# Altium schematic sheet 9.PCIE3.SchDoc
size 420 x 297 mm; SheetNumber: 9; SheetTotal: 13
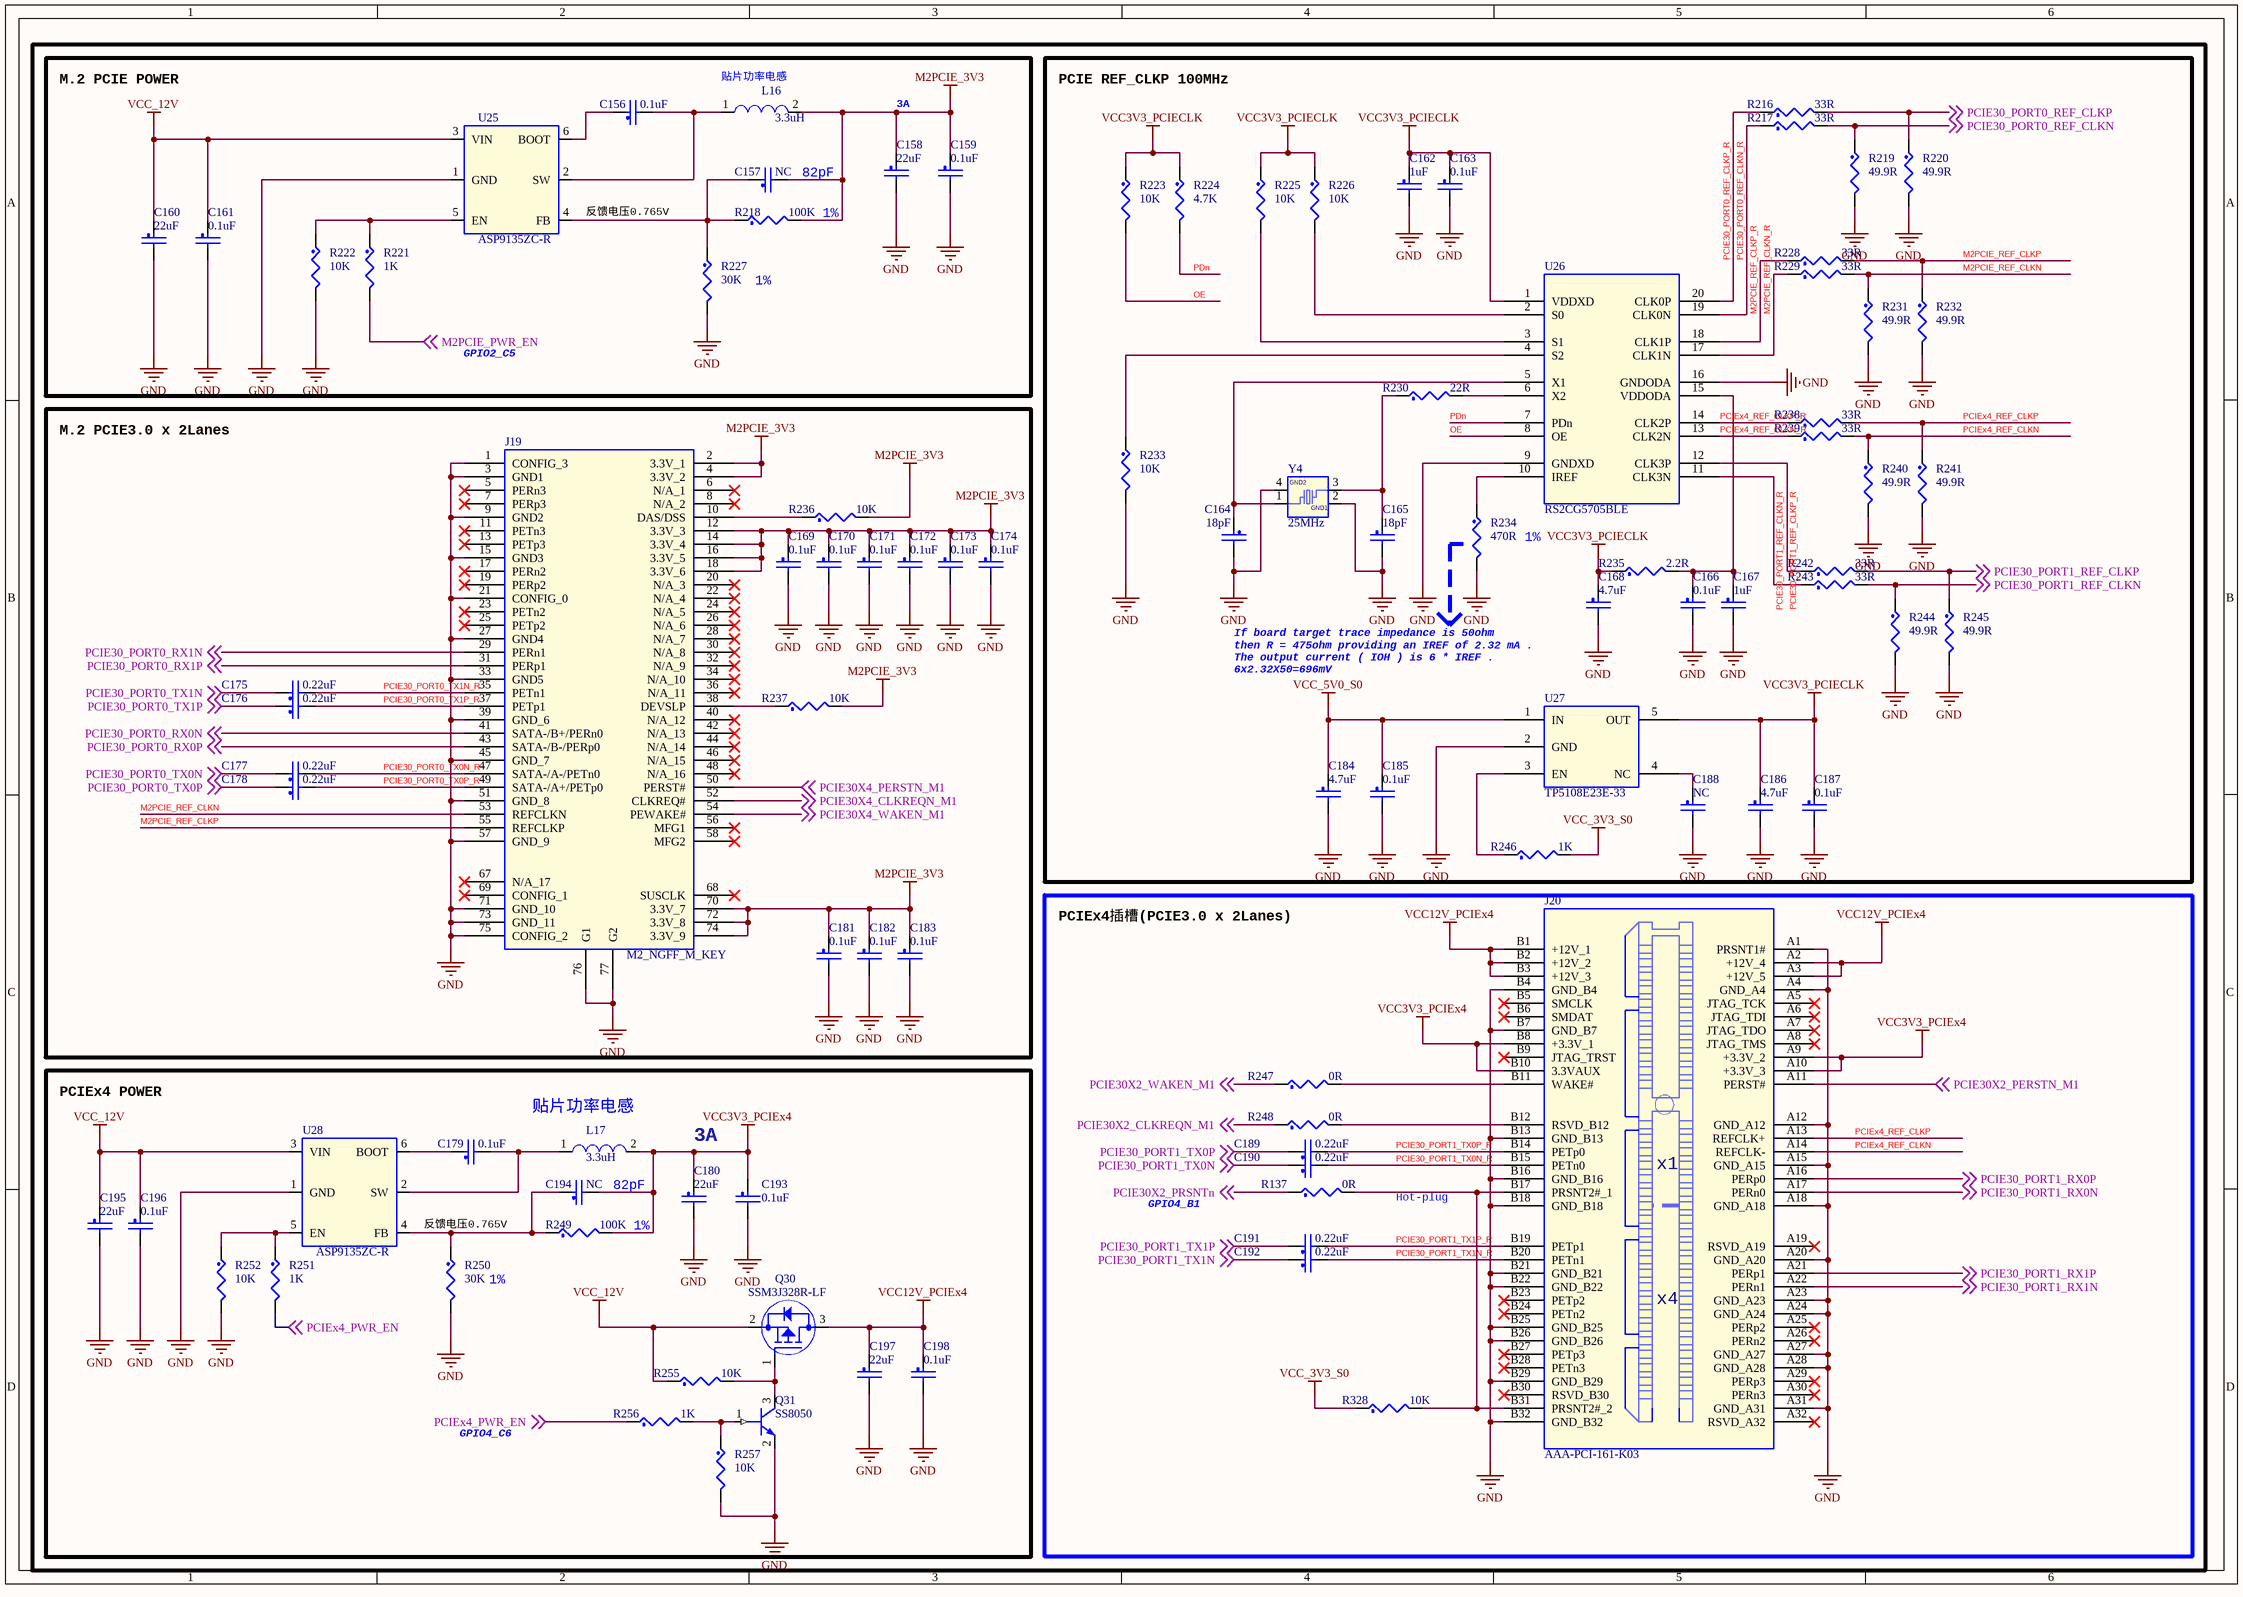
[diagram p0: 9.PCIE3.SchDoc]

## Parts
C156  0.1uF  [C0402]
C157  NC  [C0402]
C158  22uF  [C0603]
C159  0.1uF  [C0402]
C160  22uF  [C0603]
C161  0.1uF  [C0402]
C162  1uF  [C0402]
C163  0.1uF  [C0402]
C164  18pF  [C0402]
C165  18pF  [C0402]
C166  0.1uF  [C0402]
C167  1uF  [C0402]
C168  4.7uF  [C0402]
C169  0.1uF  [C0402]
C170  0.1uF  [C0402]
C171  0.1uF  [C0402]
C172  0.1uF  [C0402]
C173  0.1uF  [C0402]
C174  0.1uF  [C0402]
C175  0.22uF  [C0402]
C176  0.22uF  [C0402]
C177  0.22uF  [C0402]
C178  0.22uF  [C0402]
C179  0.1uF  [C0402]
C180  22uF  [C0603]
C181  0.1uF  [C0402]
C182  0.1uF  [C0402]
C183  0.1uF  [C0402]
C184  4.7uF  [C0402]
C185  0.1uF  [C0402]
C186  4.7uF  [C0402]
C187  0.1uF  [C0402]
C188  NC  [C0402]
C189  0.22uF  [C0402]
C190  0.22uF  [C0402]
C191  0.22uF  [C0402]
C192  0.22uF  [C0402]
C193  0.1uF  [C0402]
C194  NC  [C0402]
C195  22uF  [C0603]
C196  0.1uF  [C0402]
C197  22uF  [C0603]
C198  0.1uF  [C0402]
J19  M2_NGFF_M_KEY  [M2_NGFF_M_KEY]
J20  AAA-PCI-161-K03  [PCIE_64PIN_1R00]
L16  3.3uH  [l4520]
L17  3.3uH  [l4520]
Q30  SSM3J328R-LF  [SOT23]
Q31  SS8050  [SOT23]
R137  0R  [R0402]
R216  33R  [R0402]
R217  33R  [R0402]
R218  100K  [R0402]
R219  49.9R  [R0402]
R220  49.9R  [R0402]
R221  1K  [R0402]
R222  10K  [R0402]
R223  10K  [R0402]
R224  4.7K  [R0402]
R225  10K  [R0402]
R226  10K  [R0402]
R227  30K  [R0402]
R228  33R  [R0402]
R229  33R  [R0402]
R230  22R  [R0402]
R231  49.9R  [R0402]
R232  49.9R  [R0402]
R233  10K  [R0402]
R234  470R  [R0402]
R235  2.2R  [R0402]
R236  10K  [R0402]
R237  10K  [R0402]
R238  33R  [R0402]
R239  33R  [R0402]
R240  49.9R  [R0402]
R241  49.9R  [R0402]
R242  33R  [R0402]
R243  33R  [R0402]
R244  49.9R  [R0402]
R245  49.9R  [R0402]
R246  1K  [R0402]
R247  0R  [R0402]
R248  0R  [R0402]
R249  100K  [R0402]
R250  30K  [R0402]
R251  1K  [R0402]
R252  10K  [R0402]
R255  10K  [R0402]
R256  1K  [R0402]
R257  10K  [R0402]
R328  10K  [R0402]
U25  ASP9135ZC-R  [SOT23_6]
U26  RS2CG5705BLE  [TSSOP20]
U27  TP5108E23E-33  [SOT23-5]
U28  ASP9135ZC-R  [SOT23_6]
Y4  25MHz  [3225]

## Blocks framed on the sheet
M.2 PCIE POWER: C156-C161 L16 R218 R221 R222 R227 U25
PCIE REF_CLKP 100MHz: C162-C168 C184-C188 R216 R217 R219 R220 R223-R226 R228-R235 R238-R246 U26 U27 Y4
M.2 PCIE3.0 x 2Lanes: C169-C178 C181-C183 J19 R236 R237
PCIEx4插槽(PCIE3.0 x 2Lanes): C189-C192 J20 R137 R247 R248 R328
3A: C179 C180 C193-C198 L17 Q30 Q31 R249-R252 R255-R257 U28

## Nets
GND: C158.2 C159.2 C160.2 C161.2 C162.2 C163.2 C164.2 C165.2 C166.2 C167.2 C168.2 C169.2 C170.2 C171.2 C172.2 C173.2 C174.2 C180.2 C181.2 C182.2 C183.2 C184.2 C185.2 C186.2 C187.2 C188.2 C193.2 C195.2 C196.2 C197.2 C198.2 J19.1(CONFIG_3) J19.3(GND1) J19.9(GND2) J19.15(GND3) J19.21(CONFIG_0) J19.27(GND4) J19.33(GND5) J19.39(GND_6) J19.45(GND_7) J19.51(GND_8) J19.57(GND_9) J19.71(GND_10) J19.73(GND_11) J19.75(CONFIG_2) J19.76(G1) J19.77(G2) J20.A1(PRSNT1#) J20.A4(GND_A4) J20.A12(GND_A12) J20.A15(GND_A15) J20.A18(GND_A18) J20.A20(GND_A20) J20.A23(GND_A23) J20.A24(GND_A24) J20.A27(GND_A27) J20.A28(GND_A28) J20.A31(GND_A31) J20.B4(GND_B4) J20.B7(GND_B7) J20.B13(GND_B13) J20.B16(GND_B16) J20.B18(GND_B18) J20.B21(GND_B21) J20.B22(GND_B22) J20.B25(GND_B25) J20.B26(GND_B26) J20.B29(GND_B29) J20.B32(GND_B32) Q31.2(EMITTER) R219.2 R220.2 R222.2 R227.2 R231.2 R232.2 R233.2 R234.2 R240.2 R241.2 R244.2 R245.2 R250.2 R252.2 R257.2 U25.1(GND) U26.9(GNDXD) U26.16(GNDODA) U27.2(GND) U28.1(GND) Y4.2(GND1) Y4.4(GND2)
M2PCIE_3V3: C157.2 C158.1 C159.1 C169.1 C170.1 C171.1 C172.1 C173.1 C174.1 C181.1 C182.1 C183.1 J19.2(3.3V_1) J19.4(3.3V_2) J19.12(3.3V_3) J19.14(3.3V_4) J19.16(3.3V_5) J19.18(3.3V_6) J19.70(3.3V_7) J19.72(3.3V_8) J19.74(3.3V_9) L16.2 R218.2 R236.2 R237.2
VCC3V3_PCIECLK: C162.1 C163.1 C168.1 C186.1 C187.1 R223.1 R224.1 R225.1 R226.1 R235.1 U26.1(VDDXD) U27.5(OUT)
VCC3V3_PCIEx4: C180.1 C193.1 C194.2 J20.A9(+3.3V_2) J20.A10(+3.3V_3) J20.B8(+3.3V_1) J20.B10(3.3VAUX) L17.2 R249.2
VCC12V_PCIEx4: C197.1 C198.1 J20.A2(+12V_4) J20.A3(+12V_5) J20.B1(+12V_1) J20.B2(+12V_2) J20.B3(+12V_3) Q30.3(DRAIN)
VCC_3V3_S0: R246.2 R328.1
VCC_5V0_S0: C184.1 C185.1 U27.1(IN)
VCC_12V: C160.1 C161.1 C195.1 C196.1 Q30.2(SOURCE) R255.1 U25.3(VIN) U28.3(VIN)
M2PCIE_PWR_EN: R221.2 ; off-sheet M2PCIE_PWR_EN
M2PCIE_REF_CLKN: J19.53(REFCLKN) R229.2 R231.1
M2PCIE_REF_CLKN_R: R229.1 U26.17(CLK1N)
M2PCIE_REF_CLKP: J19.55(REFCLKP) R228.2 R232.1
M2PCIE_REF_CLKP_R: R228.1 U26.18(CLK1P)
OE: R223.2 U26.8(OE)
PCIE30_PORT0_REF_CLKN: R217.2 R219.1 ; off-sheet PCIE30_PORT0_REF_CLKN
PCIE30_PORT0_REF_CLKN_R: R217.1 U26.19(CLK0N)
PCIE30_PORT0_REF_CLKP: R216.2 R220.1 ; off-sheet PCIE30_PORT0_REF_CLKP
PCIE30_PORT0_REF_CLKP_R: R216.1 U26.20(CLK0P)
PCIE30_PORT0_RX0N: J19.41(SATA-/B+/PERn0) ; off-sheet PCIE30_PORT0_RX0N
PCIE30_PORT0_RX0P: J19.43(SATA-/B-/PERp0) ; off-sheet PCIE30_PORT0_RX0P
PCIE30_PORT0_RX1N: J19.29(PERn1) ; off-sheet PCIE30_PORT0_RX1N
PCIE30_PORT0_RX1P: J19.31(PERp1) ; off-sheet PCIE30_PORT0_RX1P
PCIE30_PORT0_TX0N: C177.1 ; off-sheet PCIE30_PORT0_TX0N
PCIE30_PORT0_TX0N_R: C177.2 J19.47(SATA-/A-/PETn0)
PCIE30_PORT0_TX0P: C178.1 ; off-sheet PCIE30_PORT0_TX0P
PCIE30_PORT0_TX0P_R: C178.2 J19.49(SATA-/A+/PETp0)
PCIE30_PORT0_TX1N: C175.1 ; off-sheet PCIE30_PORT0_TX1N
PCIE30_PORT0_TX1N_R: C175.2 J19.35(PETn1)
PCIE30_PORT0_TX1P: C176.1 ; off-sheet PCIE30_PORT0_TX1P
PCIE30_PORT0_TX1P_R: C176.2 J19.37(PETp1)
PCIE30_PORT1_REF_CLKN: R243.2 R244.1 ; off-sheet PCIE30_PORT1_REF_CLKN
PCIE30_PORT1_REF_CLKN_R: R243.1 U26.11(CLK3N)
PCIE30_PORT1_REF_CLKP: R242.2 R245.1 ; off-sheet PCIE30_PORT1_REF_CLKP
PCIE30_PORT1_REF_CLKP_R: R242.1 U26.12(CLK3P)
PCIE30_PORT1_RX0N: J20.A17(PERn0) ; off-sheet PCIE30_PORT1_RX0N
PCIE30_PORT1_RX0P: J20.A16(PERp0) ; off-sheet PCIE30_PORT1_RX0P
PCIE30_PORT1_RX1N: J20.A22(PERn1) ; off-sheet PCIE30_PORT1_RX1N
PCIE30_PORT1_RX1P: J20.A21(PERp1) ; off-sheet PCIE30_PORT1_RX1P
PCIE30_PORT1_TX0N: C190.1 ; off-sheet PCIE30_PORT1_TX0N
PCIE30_PORT1_TX0N_R: C190.2 J20.B15(PETn0)
PCIE30_PORT1_TX0P: C189.1 ; off-sheet PCIE30_PORT1_TX0P
PCIE30_PORT1_TX0P_R: C189.2 J20.B14(PETp0)
PCIE30_PORT1_TX1N: C192.1 ; off-sheet PCIE30_PORT1_TX1N
PCIE30_PORT1_TX1N_R: C192.2 J20.B20(PETn1)
PCIE30_PORT1_TX1P: C191.1 ; off-sheet PCIE30_PORT1_TX1P
PCIE30_PORT1_TX1P_R: C191.2 J20.B19(PETp1)
PCIE30X2_CLKREQN_M1: R248.1 ; off-sheet PCIE30X2_CLKREQN_M1
PCIE30X2_PERSTN_M1: J20.A11(PERST#) ; off-sheet PCIE30X2_PERSTN_M1
PCIE30X2_PRSNTn: R137.1 ; off-sheet PCIE30X2_PRSNTn
PCIE30X2_WAKEN_M1: R247.1 ; off-sheet PCIE30X2_WAKEN_M1
PCIE30X4_CLKREQN_M1: J19.52(CLKREQ#) ; off-sheet PCIE30X4_CLKREQN_M1
PCIE30X4_PERSTN_M1: J19.50(PERST#) ; off-sheet PCIE30X4_PERSTN_M1
PCIE30X4_WAKEN_M1: J19.54(PEWAKE#) ; off-sheet PCIE30X4_WAKEN_M1
PCIEx4_PWR_EN: R251.2 R256.1 ; off-sheet PCIEx4_PWR_EN
PCIEx4_REF_CLKN: J20.A14(REFCLK-) R239.2 R240.1
PCIEx4_REF_CLKN_R: R239.1 U26.13(CLK2N)
PCIEx4_REF_CLKP: J20.A13(REFCLK+) R238.2 R241.1
PCIEx4_REF_CLKP_R: R238.1 U26.14(CLK2P)
PDn: R224.2 U26.7(PDn)
NetC156_1: C156.1 U25.6(BOOT)
NetC156_2: C156.2 L16.1 U25.2(SW)
NetC157_1: C157.1 R218.1 R227.1 U25.4(FB)
NetC164_1: C164.1 U26.5(X1) Y4.1
NetC165_1: C165.1 R230.1 Y4.3
NetC166_1: C166.1 C167.1 R235.2 U26.15(VDDODA)
NetC179_1: C179.1 U28.6(BOOT)
NetC179_2: C179.2 L17.1 U28.2(SW)
NetC188_1: C188.1 U27.4(NC)
NetC194_1: C194.1 R249.1 R250.1 U28.4(FB)
NetJ19_10: J19.10(DAS/DSS) R236.1
NetJ19_38: J19.38(DEVSLP) R237.1
NetJ20_B11: J20.B11(WAKE#) R247.2
NetJ20_B12: J20.B12(RSVD_B12) R248.2
NetJ20_B17: J20.B17(PRSNT2#_1) J20.B31(PRSNT2#_2) R137.2 R328.2
NetQ30_1: Q30.1(GATE) Q31.3(COLLECTOR) R255.2
NetQ31_1: Q31.1(BASE) R256.2 R257.1
NetR221_1: R221.1 R222.1 U25.5(EN)
NetR225_2: R225.2 U26.3(S1)
NetR226_2: R226.2 U26.2(S0)
NetR230_2: R230.2 U26.6(X2)
NetR233_1: R233.1 U26.4(S2)
NetR234_1: R234.1 U26.10(IREF)
NetR246_1: R246.1 U27.3(EN)
NetR251_1: R251.1 R252.1 U28.5(EN)

Not connected (* = marked no-connect by the designer): J19 5(PERn3)* 6(N/A_1)* 7(PERp3)* 8(N/A_2)* 11(PETn3)* 13(PETp3)* 17(PERn2)* 19(PERp2)* 20(N/A_3)* 22(N/A_4)* 23(PETn2)* 24(N/A_5)* 25(PETp2)* 26(N/A_6)* 28(N/A_7)* 30(N/A_8)* 32(N/A_9)* 34(N/A_10)* 36(N/A_11)* 40(N/A_12)* 42(N/A_13)* 44(N/A_14)* 46(N/A_15)* 48(N/A_16)* 56(MFG1)* 58(MFG2)* 67(N/A_17)* 68(SUSCLK)* 69(CONFIG_1)*; J20 A5(JTAG_TCK)* A6(JTAG_TDI)* A7(JTAG_TDO)* A8(JTAG_TMS)* A19(RSVD_A19)* A25(PERp2)* A26(PERn2)* A29(PERp3)* A30(PERn3)* A32(RSVD_A32)* B5(SMCLK)* B6(SMDAT)* B9(JTAG_TRST)* B23(PETp2)* B24(PETn2)* B27(PETp3)* B28(PETn3)* B30(RSVD_B30)*

## Notes on the sheet
- (near L16) 贴片功率电感
- 3A
- 82pF
- (near U25) 反馈电压0.765V
- 1%
- GPIO2_C5
- If board target trace impedance is 50ohm
  then R = 475ohm providing an IREF of 2.32 mA .
  The output current ( IOH ) is 6 * IREF .
  6x2.32X50=696mV
- PCIEx4 POWER
- (near L17) 贴片功率电感
- GPIO4_B1
- Hot-plug
- 反馈电压0.765V
- (near R250) 1%
- GPIO4_C6
- (in symbol PCIEX4_64P) x1; x4

## Library data of the parts
C156-C198 = CAP_NP
J20 = PCIEX4_64P
L16 L17 = IND
Q30 = MOSFET_P
Q31 = NPN
R137 R216-R252 R255-R257 R328 = RES
U25 U28 = TP6327GS6
U26 = PI6C557-05BLE
U27 = LDO_PT5108
Y4 = CRYSTAL_4P